# EasyEDA Pro project RadioFox1.eprj, board PCB4
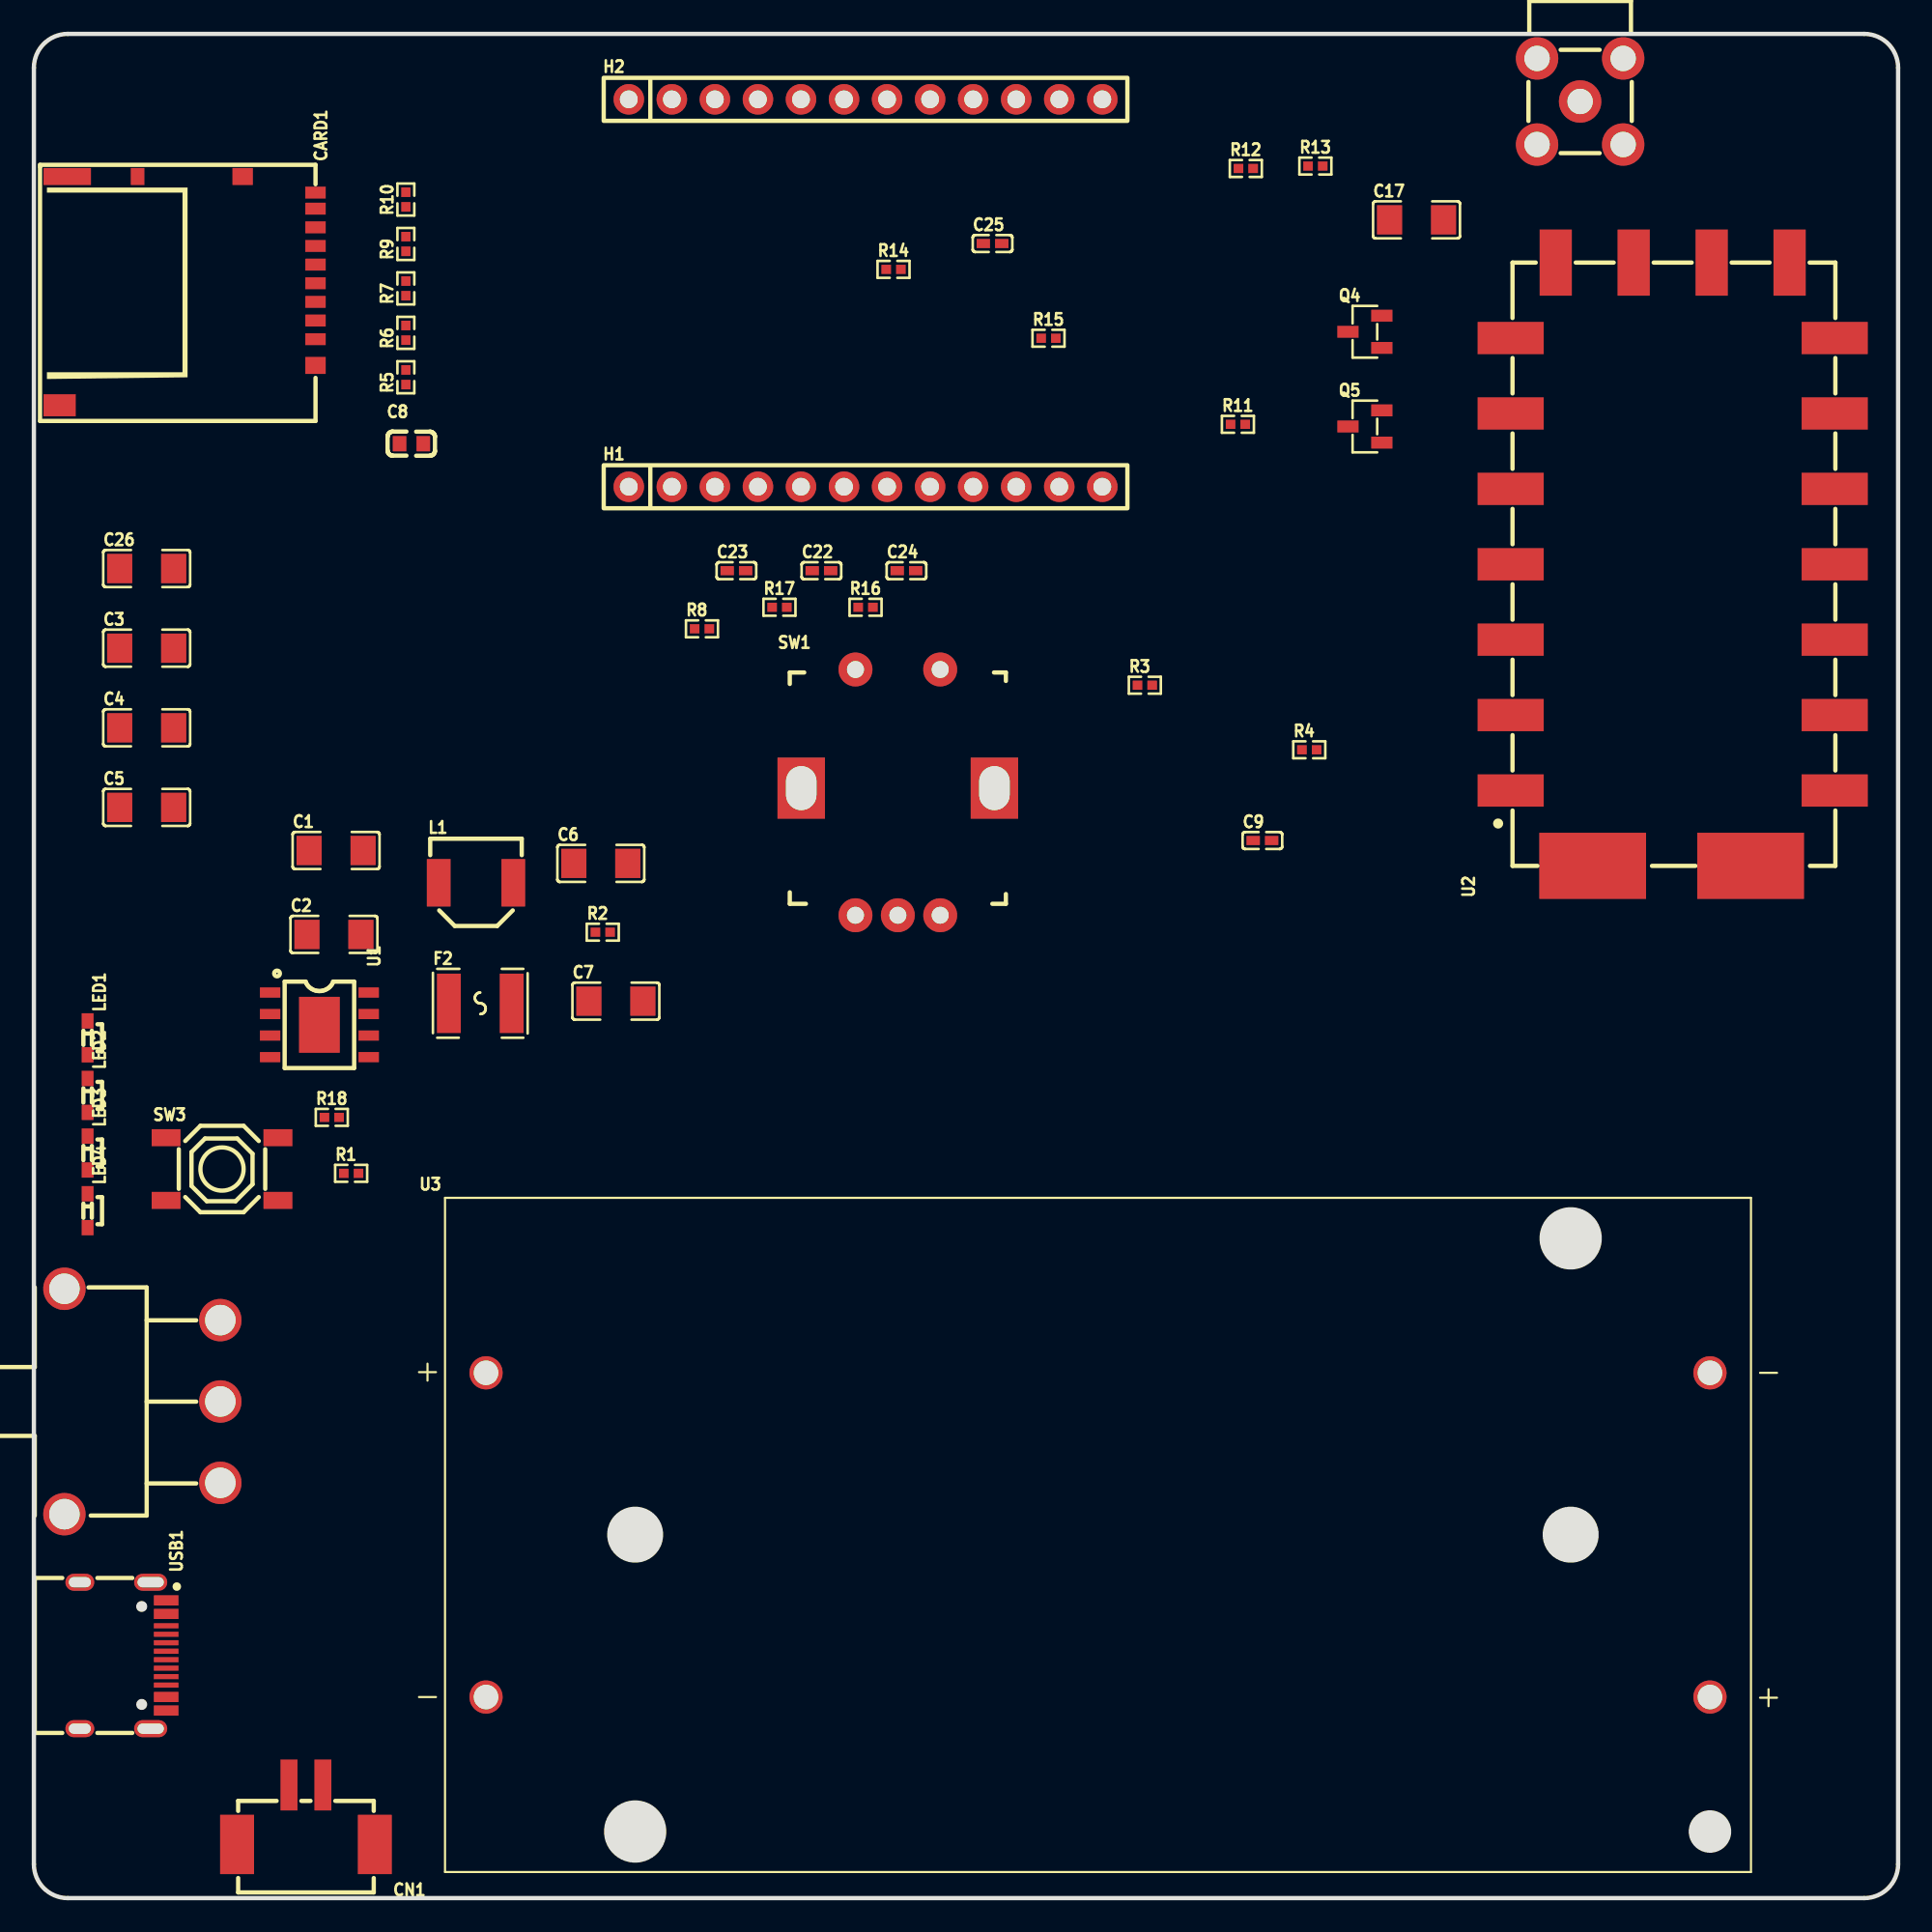
[diagram p11: board, top side]
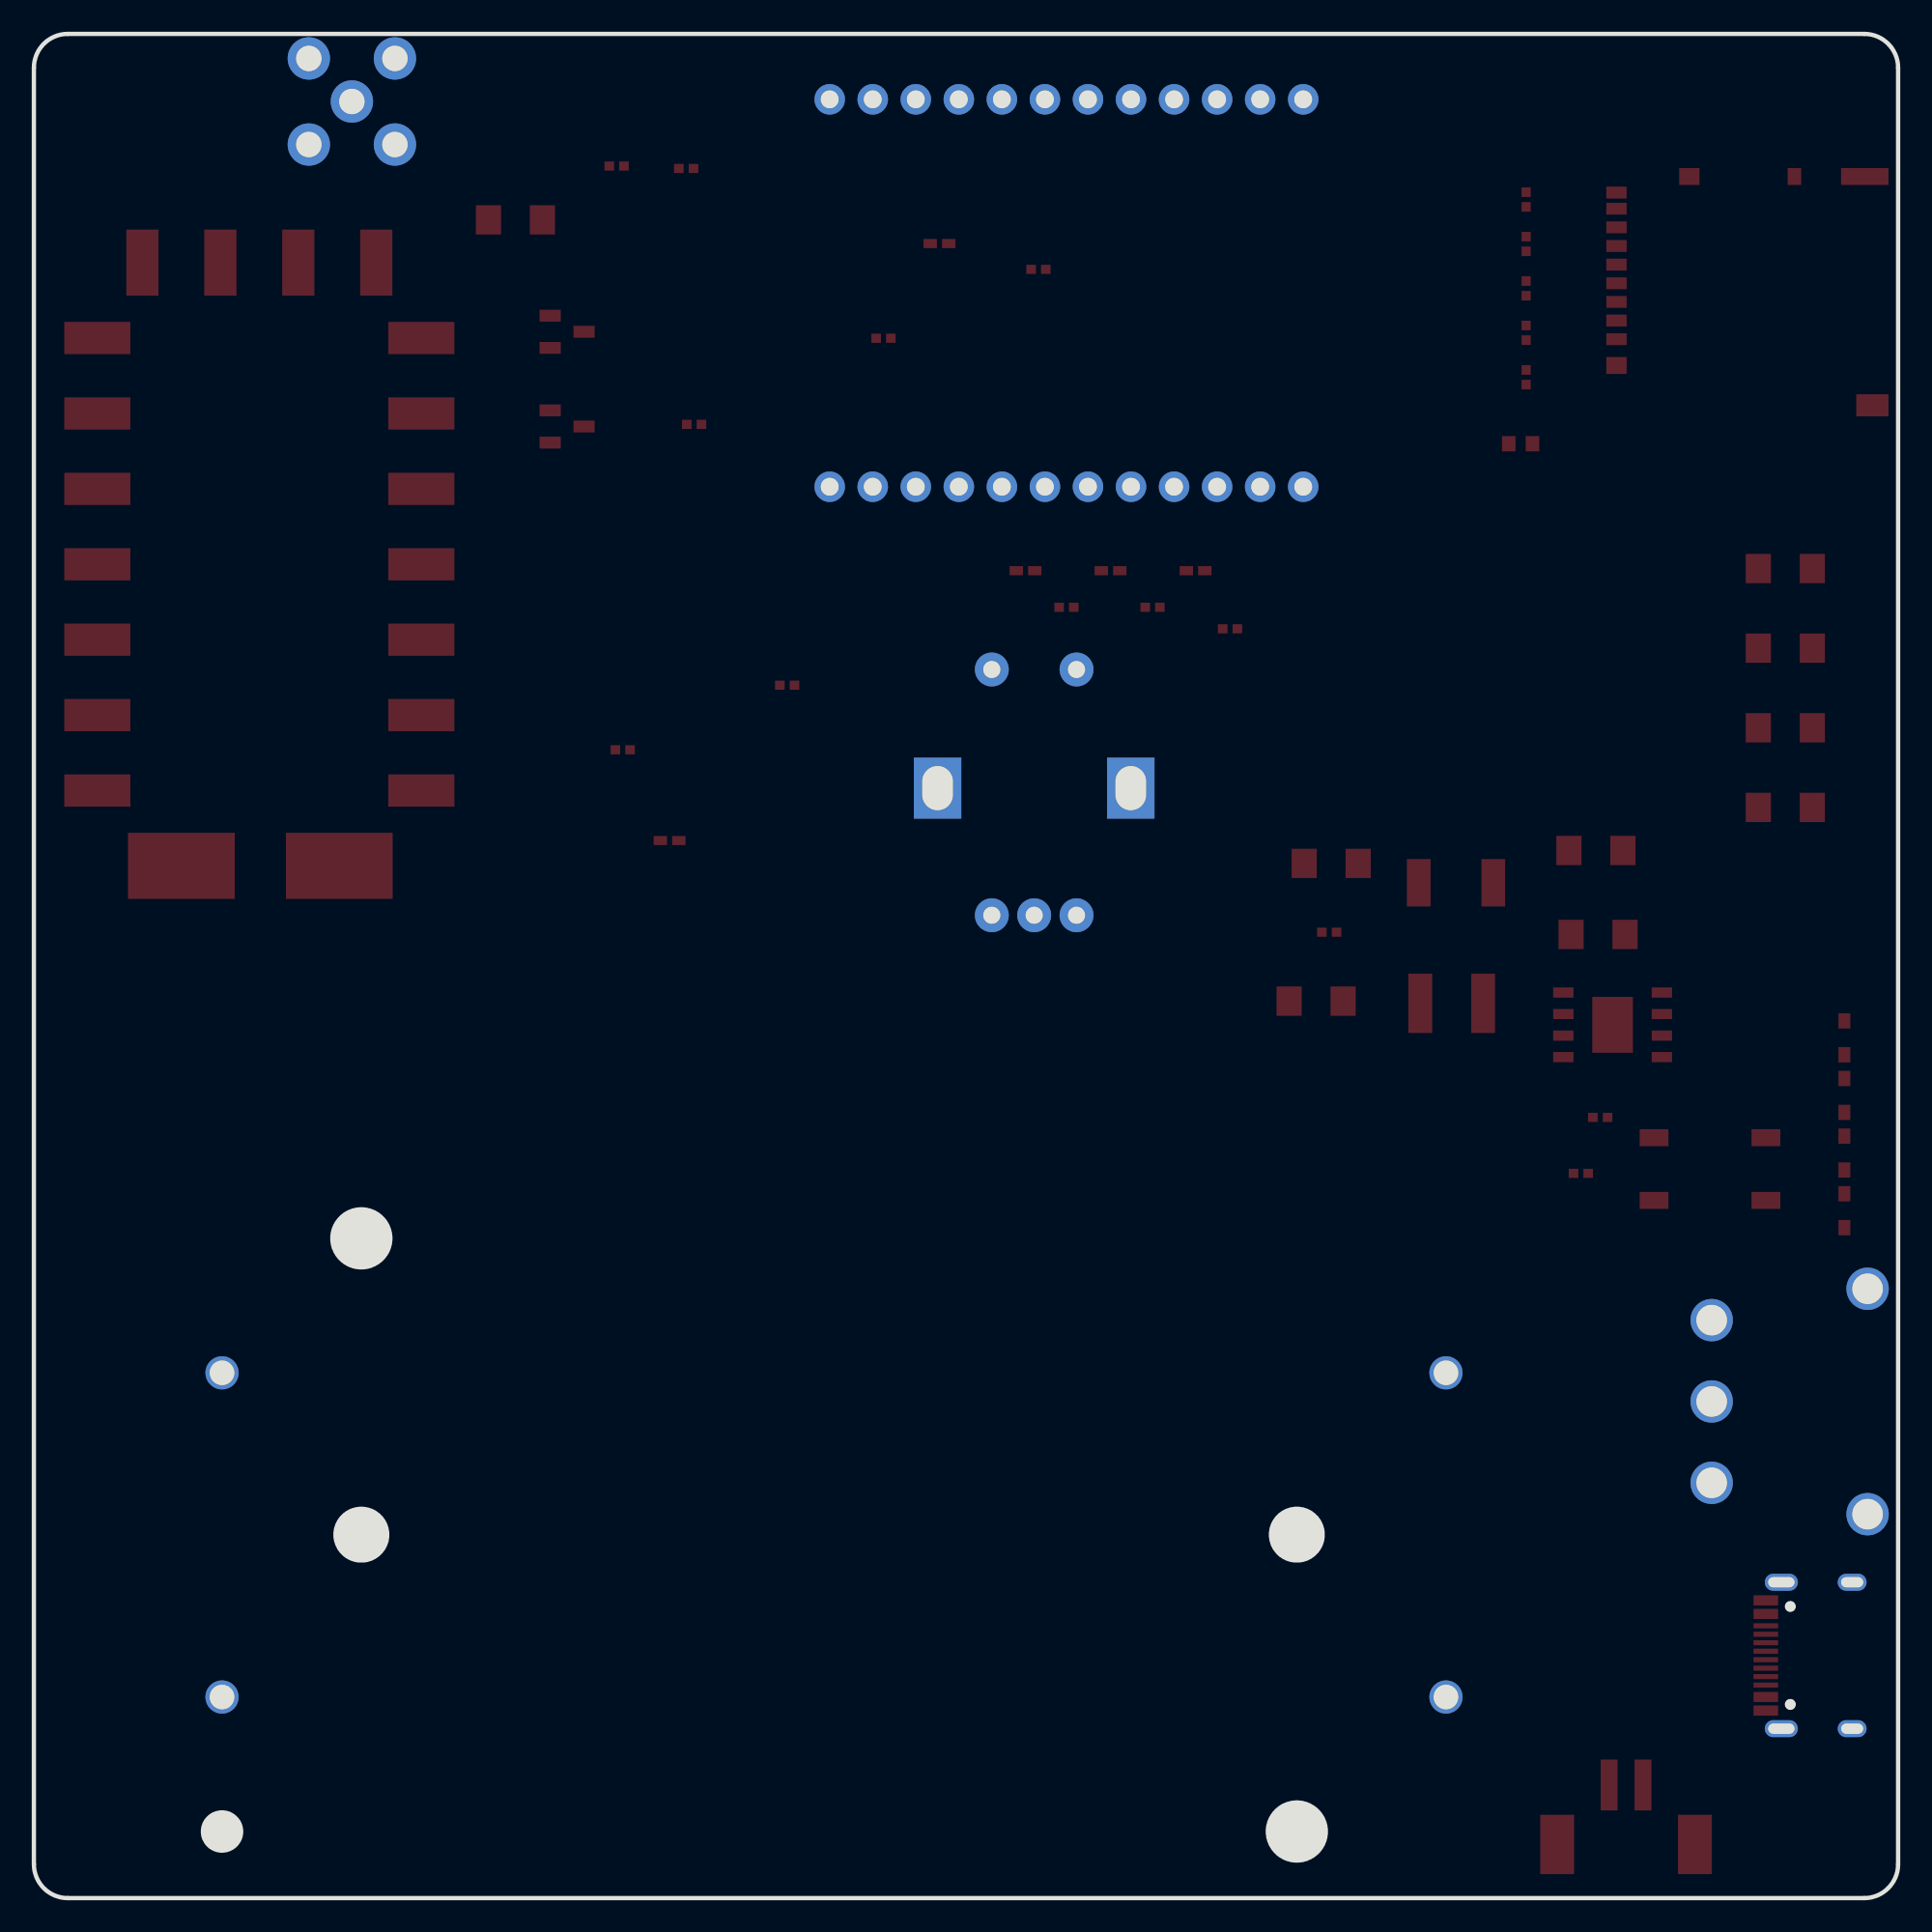
[diagram p12: board, bottom side, seen from below]

Outline 110 x 110 mm; copper layers: Top Layer, Bottom Layer. Coordinates in mm from the lower left corner of the outline.
Outline path: 0,108 0,2 arc(0.59,0.59) 2,0 108,0 arc(109.41,0.59) 110,2 110,108 arc(109.41,109.41) 108,110 2,110 arc(0.59,109.41) 0,108
Stack: Top Layer 0.035mm / Dielectric1 1.51mm FR4 er 4.5 / Bottom Layer 0.035mm

## Design rules (mm)
template: JLCPCB Capability(Two Layers Board)
spacing copperThickness1oz (default): track to track 0.102, other pairs 0.152 to 0.3
spacing copperThickness2oz: track to track 0.203, other pairs 0.152 to 0.3
track width copperThickness1oz (default): min 0.127, default 0.254, max 2.54
track width copperThickness2oz: min 0.203, default 0.254, max 2.54
differential pair differentialPair (default): width min 0.127, default 0.254, max 2.54; gap min 0.152, default 0.152
via viaSize (default): diameter min 0.5, default 0.61, max 10; hole min 0.3, default 0.305, max 6.3

## Placement (name value [footprint] x y rotation side)
C1  10uF  [C1206]  17.83 61.82 0 top
C2  10uF  [C1206]  17.7 56.86 0 top
C3  22uF  [C1206]  6.66 73.75 0 top
C4  22uF  [C1206]  6.66 69.06 0 top
C5  22uF  [C1206]  6.66 64.36 0 top
C6  10uF  [C1206]  33.45 61.05 0 top
C7  10uF  [C1206]  34.34 52.93 0 top
C8  100nF  [C0603]  22.28 85.82 0 top
C9  100nF  [C0402]  72.49 62.4 0 top
C17  10uF  [C1206]  81.59 99.03 0 top
C22  47nF  [C0402]  46.47 78.33 0 top
C23  47nF  [C0402]  41.45 78.33 0 top
C24  47nF  [C0402]  51.49 78.33 0 top
C25  10nF  [C0402]  56.57 97.63 0 top
C26  22uF  [C1206]  6.66 78.45 0 top
CARD1  DM3AT-SF-PEJM5  [SD-SMD_DM3AT-SF-PEJM5]  9.07 94.84 270 top
CN1  PH2.0-2P-LT  [CONN-SMD_PH2.0-1X2PW]  16.05 4.92 180 top
F2  BSMD1812-250-8V  [F1812]  26.34 52.8 0 top
H1  A2541HWV-12P  [HDR-TH_12P-P2.54-V-F]  49.07 83.28 0 top
H2  A2541HWV-12P  [HDR-TH_12P-P2.54-V-F]  49.07 106.14 0 top
L1  1uH  [IND-SMD_L5.4-W5.1_SPM5020]  26.09 59.91 0 top
LED1  MHS171WDT-C2  [LED-SMD_L2.0-W1.1-R-RD-SIDE_WHITE]  3.17 50.76 270 top
LED2  MHS171WDT-C2  [LED-SMD_L2.0-W1.1-R-RD-SIDE_WHITE]  3.17 47.36 270 top
LED3  MHS171WDT-C2  [LED-SMD_L2.0-W1.1-R-RD-SIDE_WHITE]  3.17 43.96 270 top
LED4  MHS171WDT-C2  [LED-SMD_L2.0-W1.1-R-RD-SIDE_WHITE]  3.17 40.56 270 top
Q4  2N7002_R1_00001  [SOT-23-3_L2.9-W1.3-P1.90-LS2.4-BR]  78.54 92.42 0 top
Q5  2N7002_R1_00001  [SOT-23-3_L2.9-W1.3-P1.90-LS2.4-BR]  78.54 86.83 0 top
R1  2Ω  [R0402]  18.72 42.77 0 top
R2  2Ω  [R0402]  33.57 56.99 0 top
R3  43kΩ  [R0402]  65.55 71.57 0 top
R4  100kΩ  [R0402]  75.26 67.76 0 top
R5  20kΩ  [R0402]  21.95 89.74 90 top
R6  20kΩ  [R0402]  21.95 92.36 90 top
R7  20kΩ  [R0402]  21.95 94.98 90 top
R8  20kΩ  [R0402]  39.42 74.9 0 top
R9  20kΩ  [R0402]  21.95 97.6 90 top
R10  20kΩ  [R0402]  21.95 100.23 90 top
R11  10K  [R0402]  71.04 86.96 0 top
R12  10kΩ  [R0402]  71.51 102.06 0 top
R13  47kΩ  [R0402]  75.62 102.2 0 top
R14  100kΩ  [R0402]  50.72 96.11 0 top
R15  100kΩ  [R0402]  59.87 92.04 0 top
R16  47kΩ  [R0402]  49.07 76.17 0 top
R17  47kΩ  [R0402]  43.99 76.17 0 top
R18  10kΩ  [R0402]  17.58 46.07 0 top
RF1  KH-SMA-P-8496  [SMA-TH_KH-SMA-P-8496]  91.24 106.01 0 top
SW1  PEC11R-4220F-S0012  [SW-TH_PEC11R-4220F-S0012]  50.98 65.25 0 top
SW3  TS-1187A-B-A-B  [SW-SMD_4P-L5.1-W5.1-P3.70-LS6.5-TL-2]  11.1 43.02 0 top
SW4  SS-12D11L5  [SW-TH_SS-12D11L5]  6.4 29.3 90 top
U1  IP5306  [ESOP-8_L4.9-W3.9-P1.27-LS6.0-BL-EP]  16.85 51.53 270 top
U2  SA818S-V  [WIRELM-SMD_G-NICERF_SA818S-X]  96.7 78.71 90 top
U3  -  [BAT_1049P]  62.79 21.43 0 top
USB1  YTC-TC16-473  [USB-SMD_YTC-TC16-473]  5.26 14.32 270 top

## Footprints (pads in the part's own frame, mm; a bottom-side part is the same pattern mirrored in y, then rotated)
BAT_1049P
  round 1.958 hole 1.45: 1(-36.11,9.565) 2(36.11,9.565) 3(-36.11,-9.565) 4(36.11,-9.565)
C0402
  rect 0.79x0.54 smd: 1(-0.545,0) 2(0.545,0)
C0603
  rect 0.8x0.9 smd: 1(-0.7,0) 2(0.7,0)
C1206
  rect 1.485x1.728 smd: 1(-1.593,0) 2(1.593,0)
CONN-SMD_PH2.0-1X2PW
  rect 1x3 smd: 1(-1,-1.756) 2(1,-1.756)
  rect 2x3.5 smd: 3(4.064,1.756) 4(-4.064,1.756)
ESOP-8_L4.9-W3.9-P1.27-LS6.0-BL-EP
  rect 0.6x1.2 smd: 1(-1.905,-2.909) 2(-0.635,-2.909) 3(0.635,-2.909) 4(1.905,-2.909) 5(1.905,2.909) 6(0.635,2.909) 7(-0.635,2.909) 8(-1.905,2.909)
  rect 3.3x2.4 smd: 9(0,0)
F1812
  rect 1.407x3.499 smd: 1(-1.853,0) 2(1.853,0)
HDR-TH_12P-P2.54-V-F
  round 1.8 hole 1.05: 1(-13.97,0) 2(-11.43,0) 3(-8.89,0) 4(-6.35,0) 5(-3.81,0) 6(-1.27,0) 7(1.27,0) 8(3.81,0) 9(6.35,0) 10(8.89,0) 11(11.43,0) 12(13.97,0)
IND-SMD_L5.4-W5.1_SPM5020
  rect 1.4x2.8 smd: 1(-2.2,0) 2(2.2,0)
LED-SMD_L2.0-W1.1-R-RD-SIDE_WHITE
  rect 0.9x0.7 smd: 1(1,0) 2(-1,0)
R0402
  rect 0.566x0.54 smd: 1(-0.433,0) 2(0.433,0)
SD-SMD_DM3AT-SF-PEJM5
  rect 0.7x1.2 smd: 1(2.85,7.55) 2(1.75,7.55) 3(0.65,7.55) 4(-0.45,7.55) 5(-1.55,7.55) 6(-2.65,7.55) 7(-3.75,7.55) 8(-4.85,7.55) 9(-5.8,7.55)
  rect 1x1.2 smd: 10(-6.75,3.25) 14(4.4,7.55)
  rect 1x0.8 smd: 11(-6.75,-2.95)
  rect 1x2.8 smd: 12(-6.75,-7.1)
  rect 1.3x1.9 smd: 13(6.75,-7.55)
SMA-TH_KH-SMA-P-8496
  round 2.5 hole 1.5: 1(-2.54,2.54) 2(2.54,2.54) 3(2.54,-2.54) 4(-2.54,-2.54) 5(0,0)
SOT-23-3_L2.9-W1.3-P1.90-LS2.4-BR
  rect 1.25x0.7 smd: 1(1,-0.95) 2(1,0.95) 3(-1,0)
SW-SMD_4P-L5.1-W5.1-P3.70-LS6.5-TL-2
  rect 1.7x1 smd: 1(-3.3,1.85) 2(3.3,1.85) 3(-3.3,-1.85) 4(3.3,-1.85)
SW-TH_PEC11R-4220F-S0012
  round 2 hole 1.005x1: 1(-2.499,7.25) 2(2.499,7.25) A(-2.499,-7.25) B(2.499,-7.25) C(0,-7.25)
  rect 2.8x3.6 hole 1.8x2.6: 3(-5.7,0.25) 3(5.7,0.25)
SW-TH_SS-12D11L5
  round 2.5 hole 1.8: 1(-4.8,-4.6) 2(0,-4.6) 3(4.8,-4.6) 4(-6.65,4.6) 5(6.65,4.6)
USB-SMD_YTC-TC16-473
  oval 1x1.95 hole 0.6x1.55: 1(-4.32,1.633) 2(4.32,1.633)
  oval 1x1.7 hole 0.6x1.3: 3(-4.32,-2.547) 4(4.32,-2.547)
  rect 0.6x1.45 smd: A1B12(-3.25,2.547) A4B9(-2.45,2.547) B1A12(3.25,2.547) B4A9(2.45,2.547)
  rect 0.3x1.45 smd: A5(-1.25,2.547) A6(-0.25,2.547) A7(0.25,2.547) A8(1.25,2.547) B5(1.75,2.547) B6(0.75,2.547) B7(-0.75,2.547) B8(-1.75,2.547)
WIRELM-SMD_G-NICERF_SA818S-X
  rect 1.9x3.9 smd: 1(-13.352,9.56) 2(-8.902,9.56) 3(-4.452,9.56) 4(-0.003,9.56) 5(4.447,9.56) 6(8.898,9.56) 7(13.348,9.56) 12(13.348,-9.56) 13(8.898,-9.56) 14(4.447,-9.56) 15(-0.003,-9.56) 16(-4.452,-9.56) 17(-8.902,-9.56) 18(-13.352,-9.56)
  rect 3.9x1.9 smd: 8(17.797,6.9) 9(17.797,2.3) 10(17.797,-2.3) 11(17.797,-6.9)
  rect 3.9x6.3 smd: 19(-17.797,-4.6) 20(-17.797,4.72)

## Nets
As in the schematic, except:
GND: C1.1 C2.1 C3.2 C4.2 C5.2 C6.1 C8.2 C9.1 C22.2 C23.2 C24.2 C25.2 C26.2 CARD1.6 CARD1.10 CARD1.12 CARD1.13 CARD1.14 CN1.1 CN1.3 CN1.4 H1.2 H2.2 H2.3 H2.11 H2.12 Q4.2 Q5.2 R2.2 R4.2 R12.2 R15.1 RF1.1 RF1.2 RF1.3 RF1.4 SW1.2 SW1.3 SW1.C SW3.3 SW3.4 SW4.4 SW4.5 U1.9 U2.9 U2.10 U2.19 U2.20 U3.2 U3.3 USB1.1 USB1.2 USB1.3 USB1.4 USB1.A1B12 USB1.B1A12
ANT: RF1.5 U2.12

Pads without a net: CARD1 9 11; H1 8; SW3 1; SW4 3; U2 1 2 4 11 13 14 15; USB1 A5 A6 A7 A8 B5 B6 B7 B8
